# Altium schematic sheet Support.SchDoc: Support
size 279 x 215 mm; DrawnBy: Connor Dack; Engineer: Connor Dack; DocumentNumber: 8; Revision: 1.0; SheetNumber: 8; SheetTotal: 11
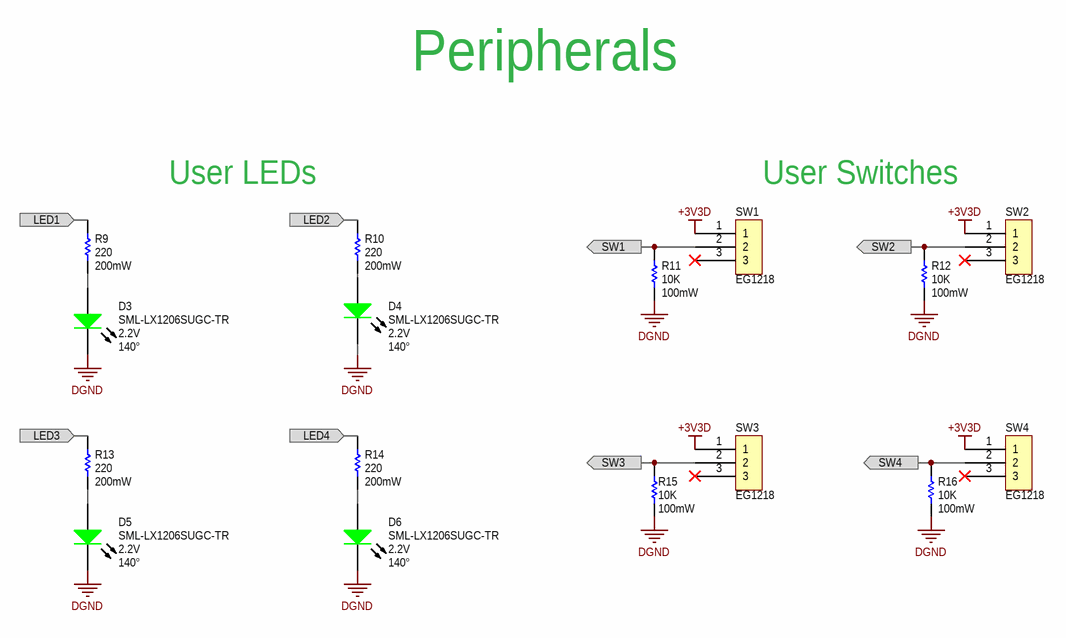
[diagram p0: Support.SchDoc]

## Parts
D3  Voltage - Forward (Vf) Typ: 2.2V  Viewing Angle: 140°  [DIOCP3216X11L]  (hidden comment: SML-LX1206SUGC-TR)
D4  Voltage - Forward (Vf) Typ: 2.2V  Viewing Angle: 140°  [DIOCP3216X11L]  (hidden comment: SML-LX1206SUGC-TR)
D5  Voltage - Forward (Vf) Typ: 2.2V  Viewing Angle: 140°  [DIOCP3216X11L]  (hidden comment: SML-LX1206SUGC-TR)
D6  Voltage - Forward (Vf) Typ: 2.2V  Viewing Angle: 140°  [DIOCP3216X11L]  (hidden comment: SML-LX1206SUGC-TR)
R9  Power (Watts): 200mW  Resistance (Ohms): 220  [3-0603_R_L]  (hidden comment: ERJ-PB3B2200V)
R10  Power (Watts): 200mW  Resistance (Ohms): 220  [3-0603_R_L]  (hidden comment: ERJ-PB3B2200V)
R11  Power (Watts): 100mW  Resistance (Ohms): 10K  [3-0603_R_L]  (hidden comment: ERJ-3GEYJ103V)
R12  Power (Watts): 100mW  Resistance (Ohms): 10K  [3-0603_R_L]  (hidden comment: ERJ-3GEYJ103V)
R13  Power (Watts): 200mW  Resistance (Ohms): 220  [3-0603_R_L]  (hidden comment: ERJ-PB3B2200V)
R14  Power (Watts): 200mW  Resistance (Ohms): 220  [3-0603_R_L]  (hidden comment: ERJ-PB3B2200V)
R15  Power (Watts): 100mW  Resistance (Ohms): 10K  [3-0603_R_L]  (hidden comment: ERJ-3GEYJ103V)
R16  Power (Watts): 100mW  Resistance (Ohms): 10K  [3-0603_R_L]  (hidden comment: ERJ-3GEYJ103V)
SW1  EG1218  [EG1218]
SW2  EG1218  [EG1218]
SW3  EG1218  [EG1218]
SW4  EG1218  [EG1218]

## Ports
LED1 (in), LED2 (in), LED3 (in), LED4 (in), SW1 (out), SW2 (out), SW3 (out), SW4 (out)

## Nets
+3V3D: SW1.1 SW2.1 SW3.1 SW4.1
DGND: D3.2(K) D4.2(K) D5.2(K) D6.2(K) R11.2 R12.2 R15.2 R16.2
LED1: R9.2 ; port LED1
LED2: R10.2 ; port LED2
LED3: R13.2 ; port LED3
LED4: R14.2 ; port LED4
SW1: R11.1 SW1.2 ; port SW1
SW2: R12.1 SW2.2 ; port SW2
SW3: R15.1 SW3.2 ; port SW3
SW4: R16.1 SW4.2 ; port SW4
NetD3_1: D3.1(A) R9.1
NetD4_1: D4.1(A) R10.1
NetD5_1: D5.1(A) R13.1
NetD6_1: D6.1(A) R14.1

Not connected (* = marked no-connect by the designer): SW1 3*; SW2 3*; SW3 3*; SW4 3*

## Notes on the sheet
- Peripherals
- User LEDs
- User Switches
- Title:
- Sheet:
- of
- Size:
- 11 x 8.5 Inches
- Rev:
- Date:
- Engineer:
- Time:
- File:
- Copyright 2020 Audio Logic Inc
  THE HARDWARE IS PROVIDED "AS IS", WITHOUT WARRANTY OF ANY KIND, EXPRESS OR IMPLIED, INCLUDING BUT NOT LIMITED TO THE WARRANTIES OF MERCHANTABILITY, FITNESS FOR A PARTICULAR PURPOSE AND NONINFRINGEMENT. IN NO EVENT SHALL THE AUTHORS OR COPYRIGHT HOLDERS BE LIABLE FOR ANY CLAIM, DAMAGES OR OTHER LIABILITY, WHETHER IN AN ACTION OF CONTRACT, TORT OR OTHERWISE, ARISING FROM, OUT OF OR IN CONNECTION WITH THE HARDWARE OR THE USE OR OTHER DEALINGS IN THE HARDWARE.

## Library data of the parts
D3-D6 = LED_GREEN 2: LED ALINGAP ULT GRN CLR 1206 SMD; Manufacturer: Lumex Opto/Components Inc; Color: Green; Millicandela Rating: 45mcd; Current - Test: 20mA; Wavelength - Peak: 574nm; Lens Type: Clear; Lens Style/Size: Rectangle with Flat Top, 2mm x 1.6mm; Supplier 1: Digi-Key; RoHS: RoHS Compliant; Category: Optoelectronics; Stock 1: 11785; Pricing 1: 1=0.64, 10=0.49, 100=0.3534, 250=0.31352, 500=0.2679, 1000=0.2109 (USD); Wavelength - Dominant: -; Package / Case: 1206 (3216 Metric); Size / Dimension: 3.20mm L x 1.60mm W; Height: 1.10mm; Mounting Type: Surface Mount; Packaging: Cut Tape (CT); Luminous Flux @ Current - Test: -; ComponentLink1URL: http://www.lumex.com/specs/SML-LX1206SUGC-TR.pdf; ComponentLink1Description: http://www.lumex.com/specs/SML-LX1206SUGC-TR.pdf; Supplier Part Number 1: 67-1698-1-ND; Manufacturer Part Number: SML-LX1206SUGC-TR; Load Status: *
R9 R10 R13 R14 = ERJ-PB3B2200V: RES SMD 220 OHM 0.1% 1/5W 0603; Manufacturer: Panasonic Electronic Components; Temperature Coefficient: ±50ppm/°C; Supplier 1: Digi-Key; Manufacturer Part Number: ERJ-PB3B2200V; RoHS: RoHS Compliant; Category: Resistors; Stock 1: 4143; Pricing 1: 1=0.24, 10=0.204, 25=0.1488, 50=0.1078, 100=0.0799, 250=0.06136, 500=0.04834, 1000=0.03346 (USD); Packaging: Cut Tape (CT); Part Status: Active; Tolerance: ±0.1%; Composition: Thick Film; Features: Automotive AEC-Q200, Pulse Withstanding; Operating Temperature: -55°C ~ 155°C; Package / Case: 0603 (1608 Metric); Supplier Device Package: 0603; Size / Dimension: 0.063" L x 0.032" W (1.60mm x 0.80mm); Height - Seated (Max): 0.022" (0.55mm); Failure Rate: -; ComponentLink1URL: https://industrial.panasonic.com/cdbs/www-data/pdf/RDM0000/AOA0000C328.pdf; ComponentLink1Description: https://industrial.panasonic.com/cdbs/www-data/pdf/RDM0000/AOA0000C328.pdf; Supplier Part Number 1: P19894CT-ND
  R9 R10 R14: Load Status: *
R11 R12 R15 R16 = ERJ-3GEYJ103V: RES 10K OHM 1/10W 5% 0603 SMD; Manufacturer: Panasonic - ECG; Temperature Coefficient: ±200ppm/°C; Supplier 1: Digi-Key; Manufacturer Part Number: ERJ-3GEYJ103V; RoHS: RoHS Compliant; Category: Resistors; Stock 1: 16219504; Pricing 1: 1=0.02, 50=0.0092, 100=0.007, 250=0.0052, 500=0.00384, 1000=0.00256 (USD); Composition: Thick Film; Features: -; Tolerance: ±5%; Package / Case: 0603 (1608 Metric); Size / Dimension: 0.063" L x 0.031" W (1.60mm x 0.80mm); Height: 0.022" (0.55mm); Number of Terminations: 2; Packaging: Cut Tape (CT); ComponentLink1URL: http://industrial.panasonic.com/www-cgi/jvcr13pz.cgi?E+PZ+3+AOA0001+ERJ3GEYJ103V+7+WW; ComponentLink1Description: http://industrial.panasonic.com/www-cgi/jvcr13pz.cgi?E+PZ+3+AOA0001+ERJ3GEYJ103V+7+WW; Supplier Part Number 1: P10KGCT-ND; Load Status: *
SW1-SW4 = EG1218: Slide Switch SPDT Through Hole; Manufacturer: E-Switch; Contact Timing: Non-Shorting (BBM); Switch Function: On-On; Current Rating: 200mA (DC); Voltage Rating - DC: 30V; Actuator Type: Standard; Actuator Length: 2.00mm; Switch Travel: 2.50mm; Operating Force: 250gf; LatestRevisionDate: 17-Jul-2002; LatestRevisionNote: Re-released for DXP Platform.; Publisher: Altium Limited; Supplier 1: Digi-Key; RoHS: RoHS Compliant; Category: Switches; Stock 1: 22149; Pricing 1: 1=0.58, 10=0.559, 25=0.5476, 50=0.4894, 100=0.466, 250=0.45436, 500=0.38446, 1000=0.3728 (USD); Packaging: Bulk; Part Status: Active; Circuit: SPDT; Voltage Rating - AC: -; Contact Material: Copper Alloy; Contact Finish: Silver; Mounting Type: Through Hole; Termination Style: PC Pin; Features: -; Actuator Material: -; Operating Temperature: -20°C ~ 70°C; Mechanical Life: -; Electrical Life: -; ComponentLink1URL: http://spec_sheets.e-switch.com/specs/P040040.pdf; ComponentLink1Description: http://spec_sheets.e-switch.com/specs/P040040.pdf; Supplier Part Number 1: EG1903-ND; Manufacturer Part Number: EG1218; Load Status: *